# Altium schematic sheet sch1.SchDoc
size 508 x 254 mm
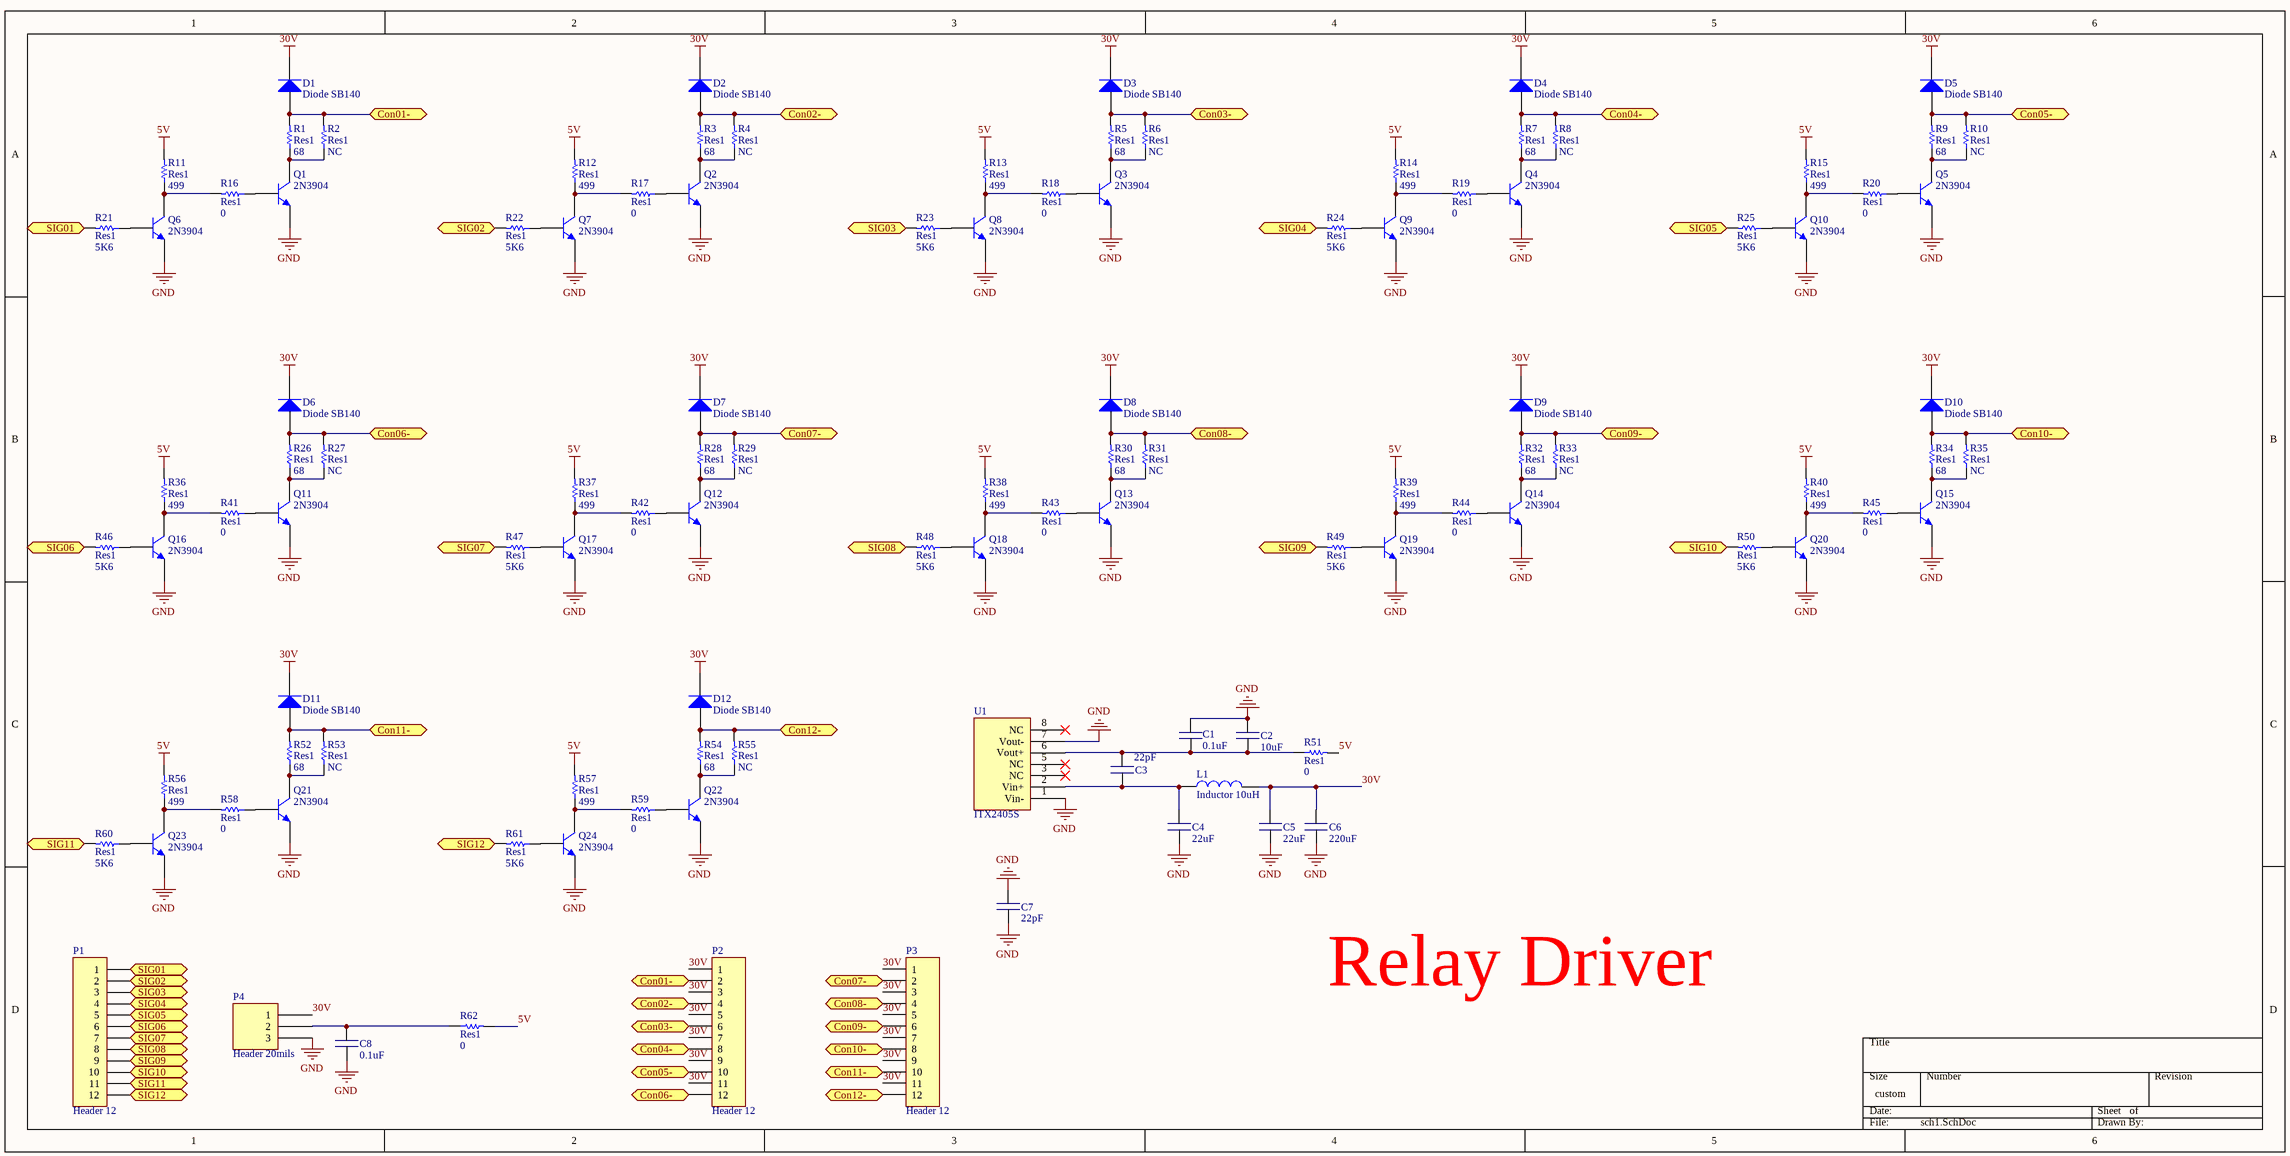
[diagram p0: sch1.SchDoc]

## Parts
C1  value 0.1uF  [0805 (2012 metric)]  (hidden comment: Cap 0603)
C2  value 10uF  [0805 (2012 metric)]  (hidden comment: Cap 0603)
C3  value 22pF  [0603 (1608 Metric)]  (hidden comment: Cap 0603)
C4  value 22uF  [0805 (2012 metric)]  (hidden comment: Cap 0603)
C5  value 22uF  [0805 (2012 metric)]  (hidden comment: Cap 0603)
C6  value 220uF  [0805 (2012 metric)]  (hidden comment: Cap 0603)
C7  value 22pF  [0603 (1608 Metric)]  (hidden comment: Cap 0603)
C8  value 0.1uF  [0603 (1608 Metric)]  (hidden comment: Cap 0603)
D1  Diode SB140  [DO-41]
D2  Diode SB140  [DO-41]
D3  Diode SB140  [DO-41]
D4  Diode SB140  [DO-41]
D5  Diode SB140  [DO-41]
D6  Diode SB140  [DO-41]
D7  Diode SB140  [DO-41]
D8  Diode SB140  [DO-41]
D9  Diode SB140  [DO-41]
D10  Diode SB140  [DO-41]
D11  Diode SB140  [DO-41]
D12  Diode SB140  [DO-41]
L1  Inductor 10uH  [Inductor Surface Mount]
P1  Header 12  [HDR1X12]
P2  Header 12  [HDR1X12]
P3  Header 12  [HDR1X12]
P4  Header 20mils  [Header_20mils]
Q1  2N3904  [TO-92A]
Q2  2N3904  [TO-92A]
Q3  2N3904  [TO-92A]
Q4  2N3904  [TO-92A]
Q5  2N3904  [TO-92A]
Q6  2N3904  [TO-92A]
Q7  2N3904  [TO-92A]
Q8  2N3904  [TO-92A]
Q9  2N3904  [TO-92A]
Q10  2N3904  [TO-92A]
Q11  2N3904  [TO-92A]
Q12  2N3904  [TO-92A]
Q13  2N3904  [TO-92A]
Q14  2N3904  [TO-92A]
Q15  2N3904  [TO-92A]
Q16  2N3904  [TO-92A]
Q17  2N3904  [TO-92A]
Q18  2N3904  [TO-92A]
Q19  2N3904  [TO-92A]
Q20  2N3904  [TO-92A]
Q21  2N3904  [TO-92A]
Q22  2N3904  [TO-92A]
Q23  2N3904  [TO-92A]
Q24  2N3904  [TO-92A]
R1  Res1  value 68  [AXIAL-0.6]
R2  Res1  value NC  [AXIAL-0.6]
R3  Res1  value 68  [AXIAL-0.6]
R4  Res1  value NC  [AXIAL-0.6]
R5  Res1  value 68  [AXIAL-0.6]
R6  Res1  value NC  [AXIAL-0.6]
R7  Res1  value 68  [AXIAL-0.6]
R8  Res1  value NC  [AXIAL-0.6]
R9  Res1  value 68  [AXIAL-0.6]
R10  Res1  value NC  [AXIAL-0.6]
R11  Res1  value 499  [6-0805_N]
R12  Res1  value 499  [6-0805_N]
R13  Res1  value 499  [6-0805_N]
R14  Res1  value 499  [6-0805_N]
R15  Res1  value 499  [6-0805_N]
R16  Res1  value 0  [6-0805_N]
R17  Res1  value 0  [6-0805_N]
R18  Res1  value 0  [6-0805_N]
R19  Res1  value 0  [6-0805_N]
R20  Res1  value 0  [6-0805_N]
R21  Res1  value 5K6  [6-0805_N]
R22  Res1  value 5K6  [6-0805_N]
R23  Res1  value 5K6  [6-0805_N]
R24  Res1  value 5K6  [6-0805_N]
R25  Res1  value 5K6  [6-0805_N]
R26  Res1  value 68  [AXIAL-0.6]
R27  Res1  value NC  [AXIAL-0.6]
R28  Res1  value 68  [AXIAL-0.6]
R29  Res1  value NC  [AXIAL-0.6]
R30  Res1  value 68  [AXIAL-0.6]
R31  Res1  value NC  [AXIAL-0.6]
R32  Res1  value 68  [AXIAL-0.6]
R33  Res1  value NC  [AXIAL-0.6]
R34  Res1  value 68  [AXIAL-0.6]
R35  Res1  value NC  [AXIAL-0.6]
R36  Res1  value 499  [6-0805_N]
R37  Res1  value 499  [6-0805_N]
R38  Res1  value 499  [6-0805_N]
R39  Res1  value 499  [6-0805_N]
R40  Res1  value 499  [6-0805_N]
R41  Res1  value 0  [6-0805_N]
R42  Res1  value 0  [6-0805_N]
R43  Res1  value 0  [6-0805_N]
R44  Res1  value 0  [6-0805_N]
R45  Res1  value 0  [6-0805_N]
R46  Res1  value 5K6  [6-0805_N]
R47  Res1  value 5K6  [6-0805_N]
R48  Res1  value 5K6  [6-0805_N]
R49  Res1  value 5K6  [6-0805_N]
R50  Res1  value 5K6  [6-0805_N]
R51  Res1  value 0  [6-0805_N]
R52  Res1  value 68  [AXIAL-0.6]
R53  Res1  value NC  [AXIAL-0.6]
R54  Res1  value 68  [AXIAL-0.6]
R55  Res1  value NC  [AXIAL-0.6]
R56  Res1  value 499  [6-0805_N]
R57  Res1  value 499  [6-0805_N]
R58  Res1  value 0  [6-0805_N]
R59  Res1  value 0  [6-0805_N]
R60  Res1  value 5K6  [6-0805_N]
R61  Res1  value 5K6  [6-0805_N]
R62  Res1  value 0  [6-0805_N]
U1  ITX2405S  [ITX2405S]

## Ports
Con01-, Con02-, Con03-, Con04-, Con05-, Con06-, Con07-, Con08-, Con09-, Con10-, Con11-, Con12-, SIG01, SIG02, SIG03, SIG04, SIG05, SIG06, SIG07, SIG08, SIG09, SIG10, SIG11, SIG12

## Nets
5V: R11.2 R12.2 R13.2 R14.2 R15.2 R36.2 R37.2 R38.2 R39.2 R40.2 R51.2 R56.2 R57.2 R62.2
30V: C5.2(OUT) C6.2(OUT) D1.2(K) D2.2(K) D3.2(K) D4.2(K) D5.2(K) D6.2(K) D7.2(K) D8.2(K) D9.2(K) D10.2(K) D11.2(K) D12.2(K) L1.2(OUT) P2.1 P2.3 P2.5 P2.7 P2.9 P2.11 P3.1 P3.3 P3.5 P3.7 P3.9 P3.11 P4.1
GND: C1.2(OUT) C2.2(OUT) C4.1(OUT) C5.1(OUT) C6.1(OUT) C7.1(OUT) C7.2(OUT) C8.1(OUT) P4.3 Q1.1(E) Q2.1(E) Q3.1(E) Q4.1(E) Q5.1(E) Q6.1(E) Q7.1(E) Q8.1(E) Q9.1(E) Q10.1(E) Q11.1(E) Q12.1(E) Q13.1(E) Q14.1(E) Q15.1(E) Q16.1(E) Q17.1(E) Q18.1(E) Q19.1(E) Q20.1(E) Q21.1(E) Q22.1(E) Q23.1(E) Q24.1(E) U1.1(Vin-) U1.7(Vout-)
Con01-: D1.1(A) P2.2 R1.2 R2.2 ; port Con01-
Con02-: D2.1(A) P2.4 R3.2 R4.2 ; port Con02-
Con03-: D3.1(A) P2.6 R5.2 R6.2 ; port Con03-
Con04-: D4.1(A) P2.8 R7.2 R8.2 ; port Con04-
Con05-: D5.1(A) P2.10 R9.2 R10.2 ; port Con05-
Con06-: D6.1(A) P2.12 R26.2 R27.2 ; port Con06-
Con07-: D7.1(A) P3.2 R28.2 R29.2 ; port Con07-
Con08-: D8.1(A) P3.4 R30.2 R31.2 ; port Con08-
Con09-: D9.1(A) P3.6 R32.2 R33.2 ; port Con09-
Con10-: D10.1(A) P3.8 R34.2 R35.2 ; port Con10-
Con11-: D11.1(A) P3.10 R52.2 R53.2 ; port Con11-
Con12-: D12.1(A) P3.12 R54.2 R55.2 ; port Con12-
SIG01: P1.1 R21.2 ; port SIG01
SIG02: P1.2 R22.2 ; port SIG02
SIG03: P1.3 R23.2 ; port SIG03
SIG04: P1.4 R24.2 ; port SIG04
SIG05: P1.5 R25.2 ; port SIG05
SIG06: P1.6 R46.2 ; port SIG06
SIG07: P1.7 R47.2 ; port SIG07
SIG08: P1.8 R48.2 ; port SIG08
SIG09: P1.9 R49.2 ; port SIG09
SIG10: P1.10 R50.2 ; port SIG10
SIG11: P1.11 R60.2 ; port SIG11
SIG12: P1.12 R61.2 ; port SIG12
NetC1_1: C1.1(OUT) C2.1(OUT) C3.2(OUT) R51.1 U1.6(Vout+)
NetC3_1: C3.1(OUT) C4.2(OUT) L1.1(OUT) U1.2(Vin+)
NetC8_2: C8.2(OUT) P4.2 R62.1
NetQ1_2: Q1.2(B) R16.1
NetQ1_3: Q1.3(C) R1.1 R2.1
NetQ2_2: Q2.2(B) R17.1
NetQ2_3: Q2.3(C) R3.1 R4.1
NetQ3_2: Q3.2(B) R18.1
NetQ3_3: Q3.3(C) R5.1 R6.1
NetQ4_2: Q4.2(B) R19.1
NetQ4_3: Q4.3(C) R7.1 R8.1
NetQ5_2: Q5.2(B) R20.1
NetQ5_3: Q5.3(C) R9.1 R10.1
NetQ6_2: Q6.2(B) R21.1
NetQ6_3: Q6.3(C) R11.1 R16.2
NetQ7_2: Q7.2(B) R22.1
NetQ7_3: Q7.3(C) R12.1 R17.2
NetQ8_2: Q8.2(B) R23.1
NetQ8_3: Q8.3(C) R13.1 R18.2
NetQ9_2: Q9.2(B) R24.1
NetQ9_3: Q9.3(C) R14.1 R19.2
NetQ10_2: Q10.2(B) R25.1
NetQ10_3: Q10.3(C) R15.1 R20.2
NetQ11_2: Q11.2(B) R41.1
NetQ11_3: Q11.3(C) R26.1 R27.1
NetQ12_2: Q12.2(B) R42.1
NetQ12_3: Q12.3(C) R28.1 R29.1
NetQ13_2: Q13.2(B) R43.1
NetQ13_3: Q13.3(C) R30.1 R31.1
NetQ14_2: Q14.2(B) R44.1
NetQ14_3: Q14.3(C) R32.1 R33.1
NetQ15_2: Q15.2(B) R45.1
NetQ15_3: Q15.3(C) R34.1 R35.1
NetQ16_2: Q16.2(B) R46.1
NetQ16_3: Q16.3(C) R36.1 R41.2
NetQ17_2: Q17.2(B) R47.1
NetQ17_3: Q17.3(C) R37.1 R42.2
NetQ18_2: Q18.2(B) R48.1
NetQ18_3: Q18.3(C) R38.1 R43.2
NetQ19_2: Q19.2(B) R49.1
NetQ19_3: Q19.3(C) R39.1 R44.2
NetQ20_2: Q20.2(B) R50.1
NetQ20_3: Q20.3(C) R40.1 R45.2
NetQ21_2: Q21.2(B) R58.1
NetQ21_3: Q21.3(C) R52.1 R53.1
NetQ22_2: Q22.2(B) R59.1
NetQ22_3: Q22.3(C) R54.1 R55.1
NetQ23_2: Q23.2(B) R60.1
NetQ23_3: Q23.3(C) R56.1 R58.2
NetQ24_2: Q24.2(B) R61.1
NetQ24_3: Q24.3(C) R57.1 R59.2

Not connected (* = marked no-connect by the designer): U1 3(NC)* 5(NC)* 8(NC)*

## Notes on the sheet
- Relay Driver

## Library data of the parts
C1-C8 = Cap 0603: 0603 Cap
D1-D12 = Diode 1N4006: 1 Amp General Purpose Rectifier; Published: 8-Jun-2000; LatestRevisionDate: 17-Jul-2002; LatestRevisionNote: Re-released for DXP Platform.; DatasheetVersion: 1998; PackageVersion: Aug-1999; PackageReference: DO-41; Publisher: Altium Limited; PackageDescription: Diode, Axial; Body 5.2 x 2.7 mm (LxDia. max), Lead Dia. 0.86 mm (max); Code_JEDEC: DO-204-AL; ComponentLink1Description: Manufacturer Link; ComponentLink1URL: http://www.fairchildsemi.com/; ComponentLink2Description: Datasheet; ComponentLink2URL: http://www.fairchildsemi.com/ds/1N%2F1N4001.pdf
L1 = Inductor 10uH: Surface Mount Inductor 744043100
P1-P3 = Header 12: Header, 12-Pin; LatestRevisionDate: 17-Jul-2002; LatestRevisionNote: Re-released for DXP Platform.; Publisher: Altium Limited
Q1-Q24 = 2N3904: NPN General Purpose Amplifier; Published: 8-Jun-2000; LatestRevisionDate: 15-Jan-2003; LatestRevisionNote: PCB Footprint 'BCY-W3/D4.7' replaced; DatasheetVersion: 1997; PackageVersion: Sep-1998; PackageReference: TO-92A; Publisher: Altium Limited; PackageDescription: TO, Flat Index; 3 In-Line, Axial Leads; Body Dia. 4.5mm; Leads 0.51 x 0.48 mm (max); ComponentLink1Description: Manufacturer Link; ComponentLink1URL: http://www.fairchildsemi.com/; ComponentLink2Description: Datasheet; ComponentLink2URL: http://www.fairchildsemi.com/ds/2N%2F2N3904.pdf
R1-R62 = Res1: Resistor; Published: 8-Jun-2000; LatestRevisionDate: 17-Jul-2002; LatestRevisionNote: Re-released for DXP Platform.; PackageReference: AXIAL-0.3; Publisher: Altium Limited; PackageDescription: Axial Device, Thru-Hole; 2 Leads; 0.3 in Pin Spacing